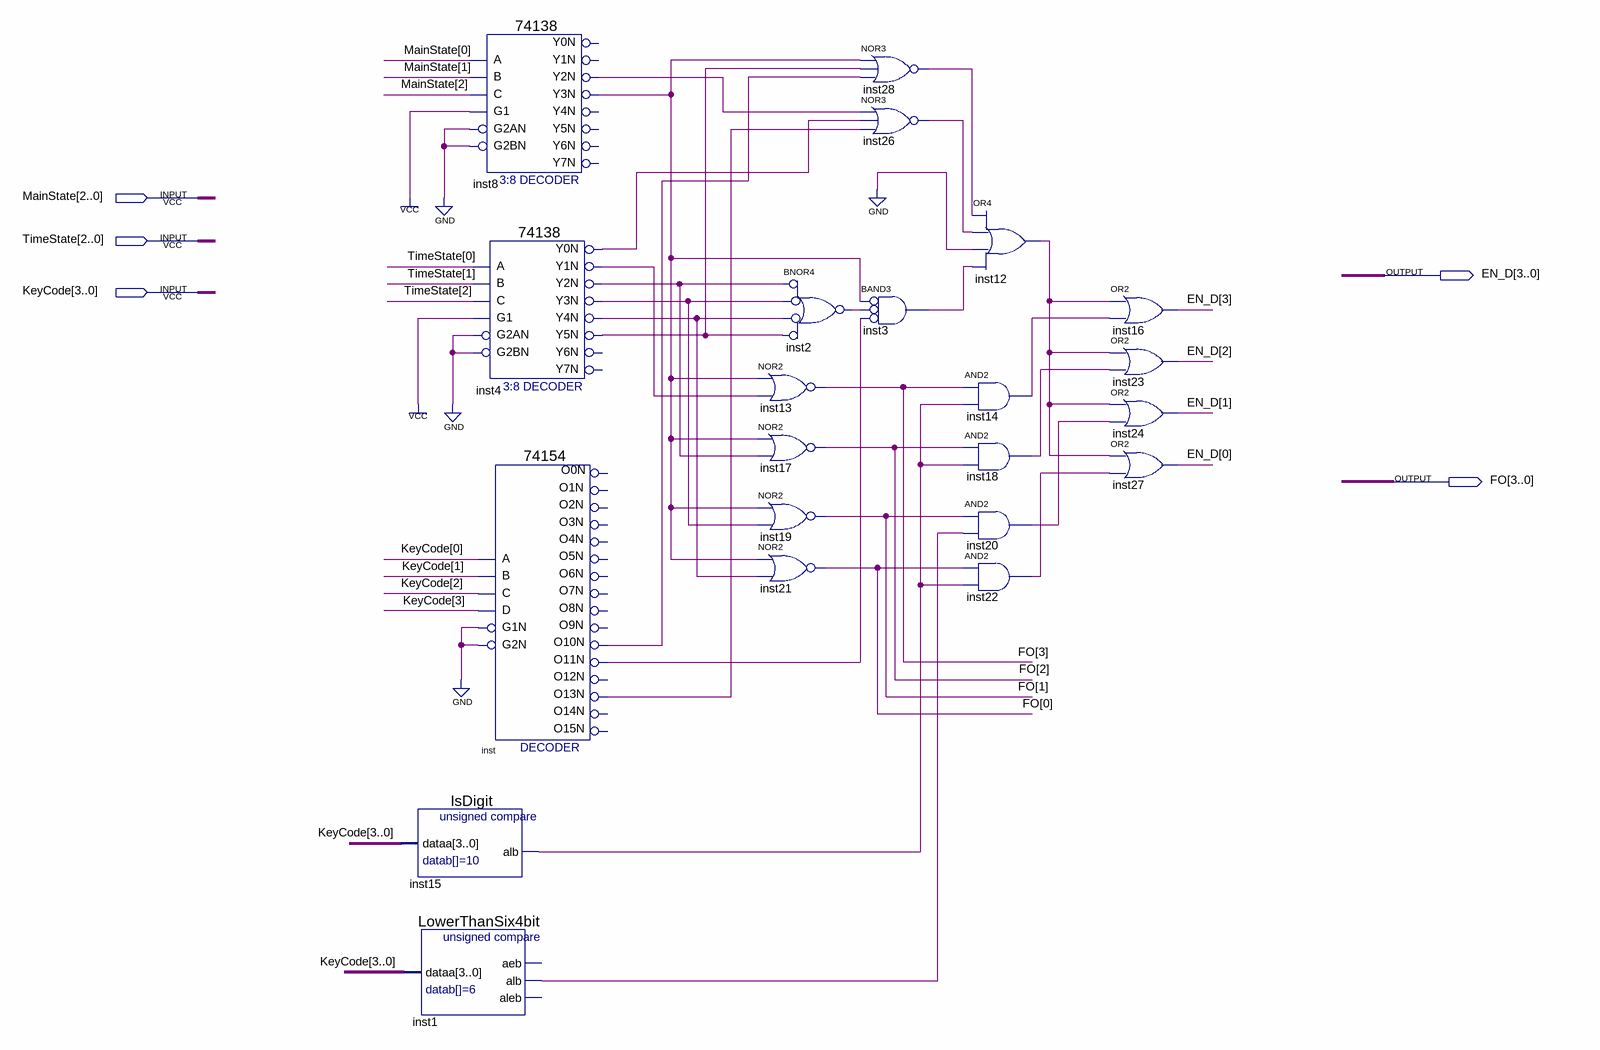
[diagram p0: schematic sheet]
// Quartus schematic TimeDENControl.bdf as structural Verilog: 22 symbols, 5 pins
module TimeDENControl (
  input  [2:0] MainState,
  input  [2:0] TimeState,
  input  [3:0] KeyCode,
  output [3:0] EN_D,
  output [3:0] FO
);

  wire inst1_alb, inst2_out, inst3_out, inst4_y0n, inst4_y1n, inst4_y2n, inst4_y3n, inst4_y4n, inst4_y5n,
       inst8_y2n, inst8_y3n, inst12_out, inst14_out, inst15_alb, inst18_out, inst20_out, inst22_out,
       inst26_out, inst28_out, inst_o10n, inst_o11n, inst_o13n;

  IsDigit inst15 (.dataa(KeyCode), .alb(inst15_alb));
  LowerThanSix4bit inst1 (.dataa(KeyCode), .alb(inst1_alb));  // open: aeb, aleb
  \74138  inst8 (
    .A(MainState[0]), .B(MainState[1]), .G1(1'b1), .C(MainState[2]), .G2AN(1'b0), .G2BN(1'b0),
    .Y2N(inst8_y2n), .Y3N(inst8_y3n));  // open: Y0N, Y1N, Y4N, Y5N, Y6N, Y7N
  \74138  inst4 (
    .A(TimeState[0]), .B(TimeState[1]), .G1(1'b1), .C(TimeState[2]), .G2AN(1'b0), .G2BN(1'b0),
    .Y0N(inst4_y0n), .Y1N(inst4_y1n), .Y2N(inst4_y2n), .Y3N(inst4_y3n), .Y4N(inst4_y4n), .Y5N(inst4_y5n));  // open: Y6N, Y7N
  \74154  inst (
    .C(KeyCode[2]), .D(KeyCode[3]), .B(KeyCode[1]), .A(KeyCode[0]), .G1N(1'b0), .G2N(1'b0), .O10N(inst_o10n),
    .O11N(inst_o11n), .O13N(inst_o13n));  // open: O0N, O12N, O15N, O1N, O14N, O4N, O3N, O2N, O7N, O6N, O5N, O9N, O8N
  nor inst2 (inst2_out, ~inst4_y2n, ~inst4_y3n, ~inst4_y4n, ~inst4_y5n);  // BNOR4
  nor inst13 (FO[3], inst8_y3n, inst4_y1n);
  nor inst17 (FO[2], inst8_y3n, inst4_y2n);
  nor inst19 (FO[1], inst8_y3n, inst4_y3n);
  nor inst21 (FO[0], inst8_y3n, inst4_y4n);
  nor inst28 (inst28_out, inst8_y3n, inst4_y5n, inst_o10n);
  nor inst26 (inst26_out, inst8_y2n, inst4_y0n, inst_o13n);
  and inst3 (inst3_out, ~inst8_y3n, ~inst2_out, ~inst_o11n);  // BAND3
  or inst12 (inst12_out, inst28_out, inst26_out, 1'b0, inst3_out);
  and inst14 (inst14_out, FO[3], inst15_alb);
  and inst18 (inst18_out, FO[2], inst15_alb);
  and inst20 (inst20_out, FO[1], inst1_alb);
  and inst22 (inst22_out, FO[0], inst15_alb);
  or inst16 (EN_D[3], inst12_out, inst14_out);
  or inst23 (EN_D[2], inst12_out, inst18_out);
  or inst24 (EN_D[1], inst12_out, inst20_out);
  or inst27 (EN_D[0], inst12_out, inst22_out);
endmodule
